# EAGLE design Hub USB 2.0 (EAGLE 7.7.0)
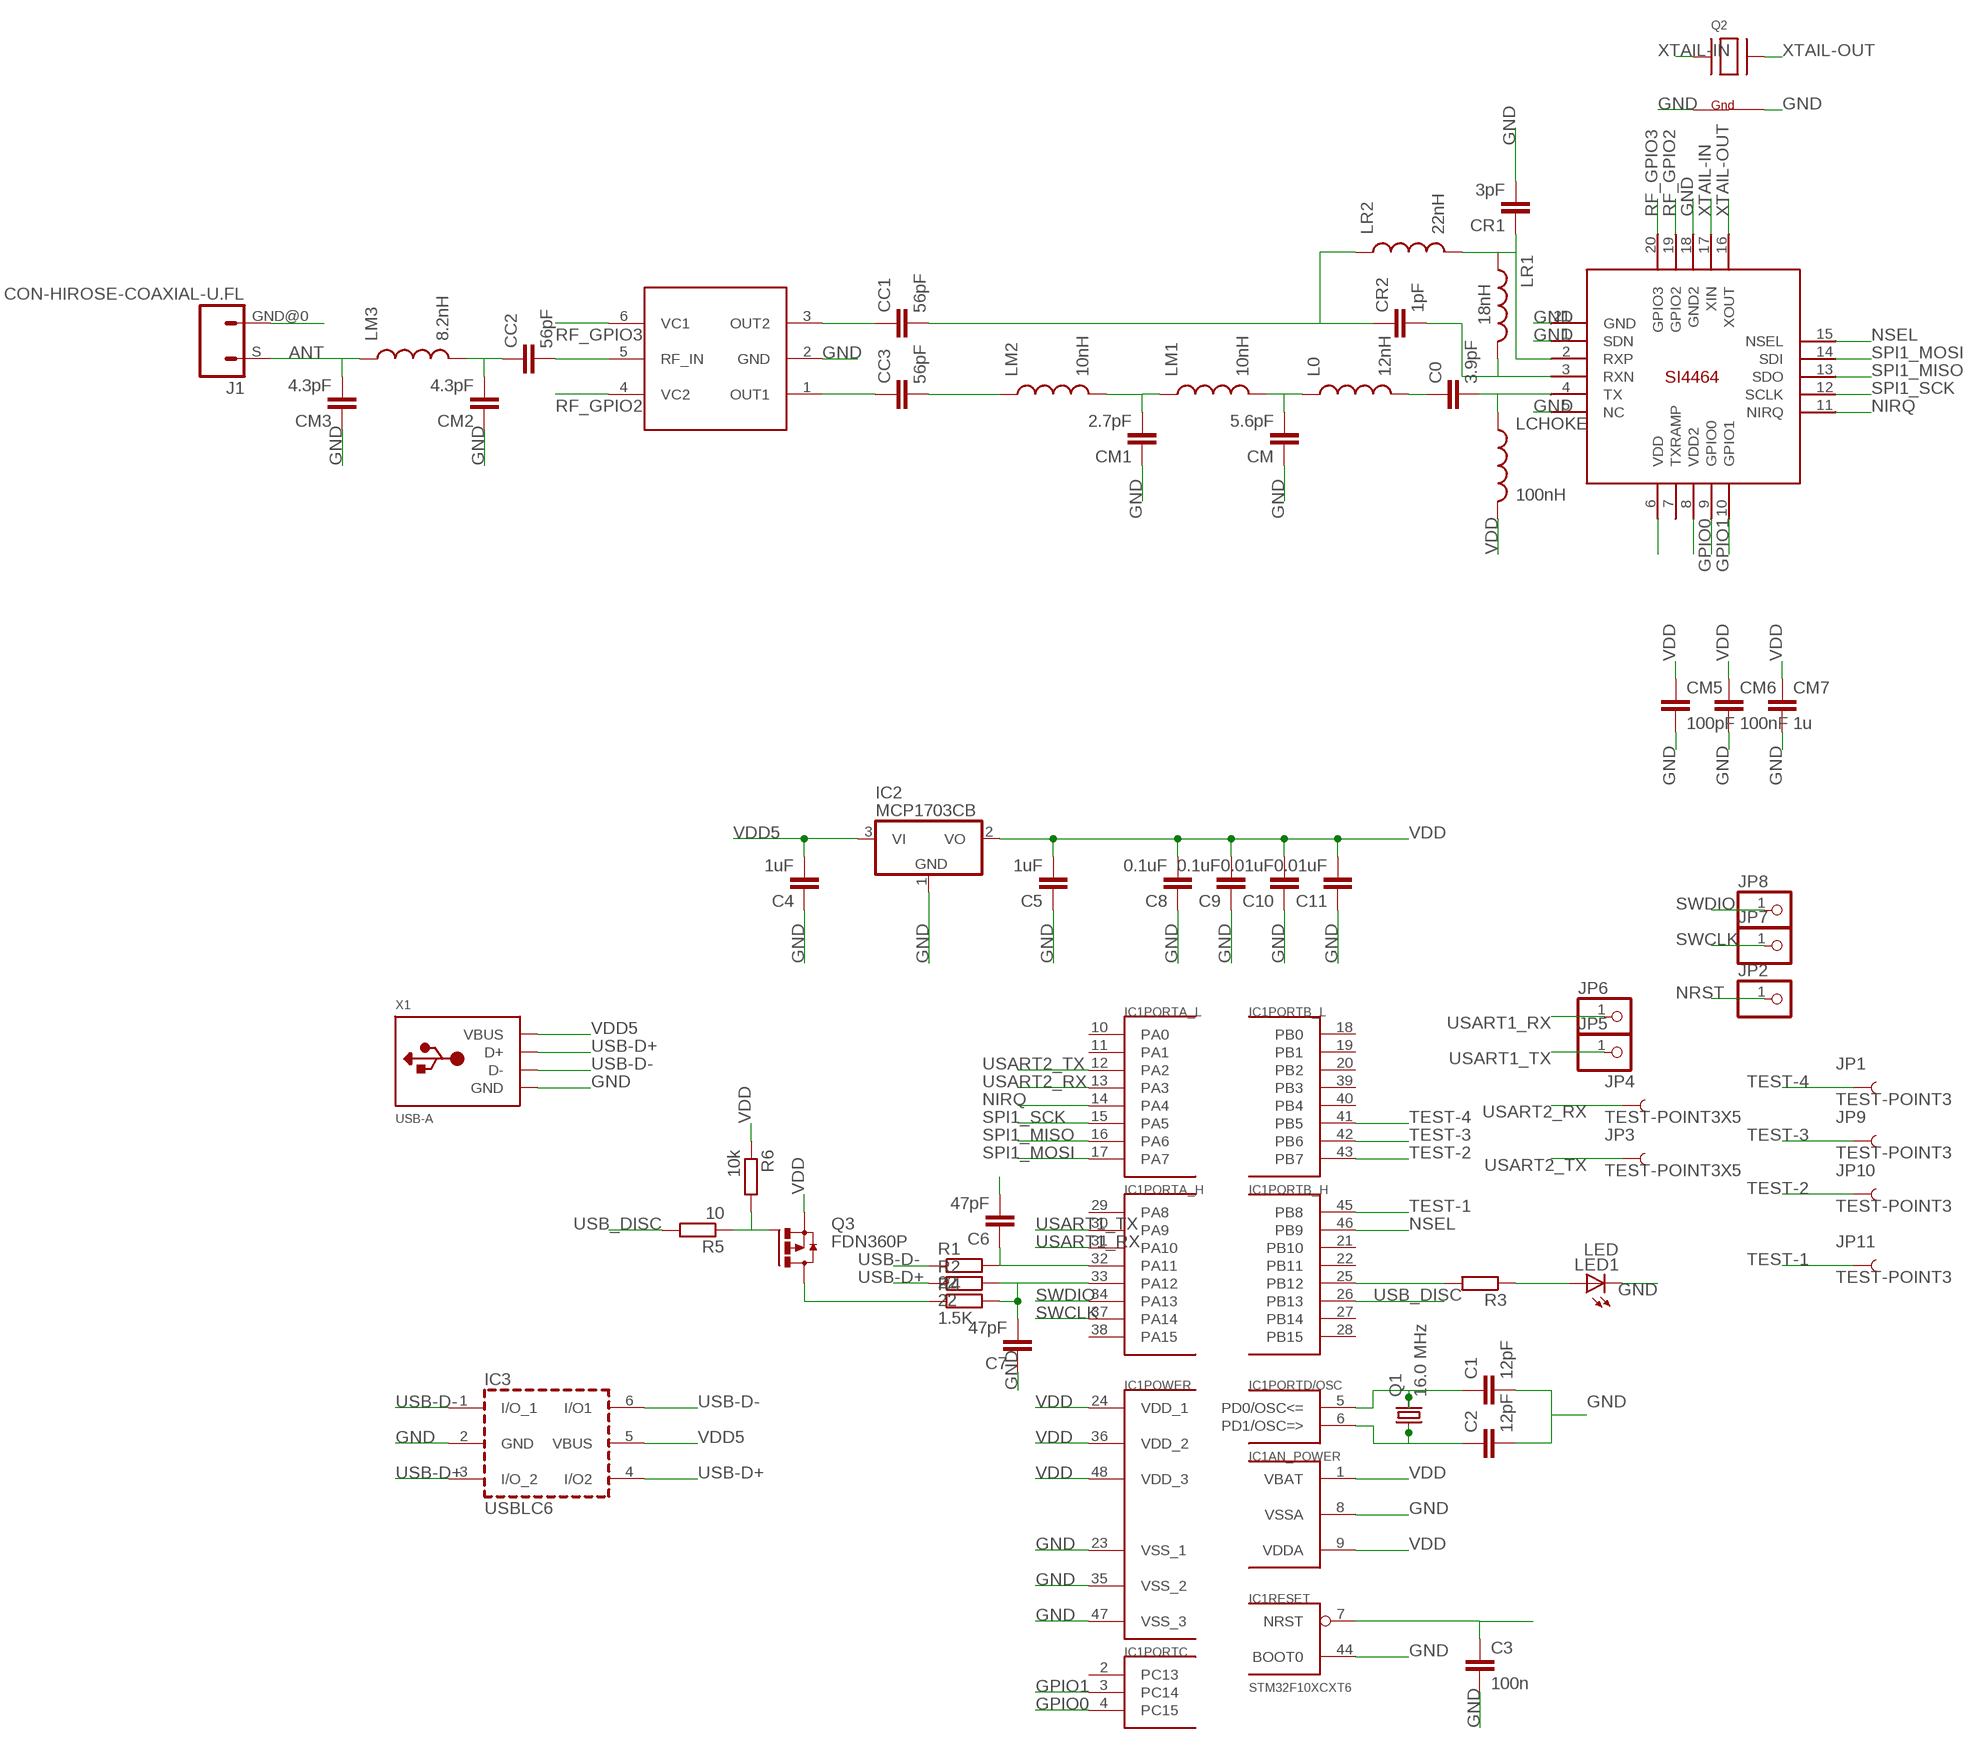
[diagram p0: schematic, sheet 1]

## Parts
C0  3.9pF  C-EUC0402  [C0402]
C1  12pF  C-EUC0603K  [C0603K]
C2  12pF  C-EUC0603K  [C0603K]
C3  100n  C-EUC0805  [C0805]
C4  1uF  C-EUC0805  [C0805]
C5  1uF  C-EUC0805  [C0805]
C6  47pF  C-EUC0805  [C0805]
C7  47pF  C-EUC0805  [C0805]
C8  0.1uF  C-EUC0805  [C0805]
C9  0.1uF  C-EUC0805  [C0805]
C10  0.01uF  C-EUC0805  [C0805]
C11  0.01uF  C-EUC0805  [C0805]
CC1  56pF  C-EUC0402  [C0402]
CC2  56pF  C-EUC0402  [C0402]
CC3  56pF  C-EUC0402  [C0402]
CM  5.6pF  C-EUC0402  [C0402]
CM1  2.7pF  C-EUC0402  [C0402]
CM2  4.3pF  C-EUC0402  [C0402]
CM3  4.3pF  C-EUC0402  [C0402]
CM5  100pF  C-EUC0402  [C0402]
CM6  100nF  C-EUC0402  [C0402]
CM7  1u  C-EUC0402  [C0402]
CR1  3pF  C-EUC0402  [C0402]
CR2  1pF  C-EUC0402  [C0402]
IC1  STM32F10XCXT6  [TQFP48]
IC2  MCP1703CB  [SOT23]
IC3  USBLC6  IC_USBLC6-2  [SOT-23-6L]
J1  CON-HIROSE-COAXIAL-U.FL  [CON-U.FL]
JP1  TEST-POINT3  [PAD.03X.03]
JP2  PINHD-1X1  [1X01]
JP3  TEST-POINT3X5  [PAD.03X.05]
JP4  TEST-POINT3X5  [PAD.03X.05]
JP5  PINHD-1X1CB  [1X01-CLEANBIG]
JP6  PINHD-1X1CB  [1X01-CLEANBIG]
JP7  PINHD-1X1  [1X01]
JP8  PINHD-1X1  [1X01]
JP9  TEST-POINT3  [PAD.03X.03]
JP10  TEST-POINT3  [PAD.03X.03]
JP11  TEST-POINT3  [PAD.03X.03]
L0  12nH  INDUCTOR0402  [C0402]
LCHOKE  100nH  INDUCTOR0402  [C0402]
LED1  LED  LEDCHIPLED_0805  [CHIPLED_0805]
LM1  10nH  INDUCTOR0402  [C0402]
LM2  10nH  INDUCTOR0402  [C0402]
LM3  8.2nH  INDUCTOR0402  [C0402]
LR1  18nH  INDUCTOR0402  [C0402]
LR2  22nH  INDUCTOR0402  [C0402]
Q1  16.0 MHz  CRYSTAL3.2X2.5  [CRYSTAL-SMD-3.2X2.5]
Q2  XTAL-4-3225  [NX3225]
Q3  FDN360P  [SUPER-SOT3]
R1  22  R-EU_R0805  [R0805]
R2  22  R-EU_R0805  [R0805]
R3  R-EU_R0805  [R0805]
R4  1.5K  R-EU_R0805  [R0805]
R5  10  R-EU_R0805  [R0805]
R6  10k  R-EU_R0805  [R0805]
U$1  SI4464  [QFN20+GNDPAD]
U$2  UPG2179TB  [SUPER_MINIMOLD]
X1  USB-A  [MOLEX_480371000]

## Nets
ANT: CM3.2 J1.S LM3.1
GND: C1.2 C2.2 C3.2 C4.1 C5.1 C6.2 C7.1 C8.1 C9.1 C10.1 C11.1 CM1.1 CM2.1 CM3.1 CM5.2 CM6.2 CM7.2 CM.1 CR1.2 IC1.8(AN_POWER:VSSA) IC1.23(POWER:VSS_1) IC1.35(POWER:VSS_2) IC1.44(RESET:BOOT0) IC1.47(POWER:VSS_3) IC2.1(GND) IC3.2(GND) J1.GND@0 LED1.C Q2.2(G2) Q2.4(G1) U$1.1(SDN) U$1.5(NC ) U$1.18(GND2) U$1.21(GND) U$2.2(GND) X1.4(GND)
GPIO0: IC1.4(PORTC:PC15) U$1.9(GPIO0)
GPIO1: IC1.3(PORTC:PC14) U$1.10(GPIO1)
N$1: C1.1 IC1.5(PORTD/OSC:PD0/OSC<=) Q1.3
N$2: C2.1 IC1.6(PORTD/OSC:PD1/OSC=>) Q1.1
N$3: C0.2 LCHOKE.1 U$1.4(TX)
N$4: LED1.A R3.1
N$5: C0.1 L0.2
N$6: C7.2 IC1.33(PORTA_H:PA12) R2.2 R4.2
N$7: CM.2 L0.1 LM1.2
N$8: CM1.2 LM1.1 LM2.2
N$9: CC2.1 CM2.2 LM3.2
N$10: C6.1 IC1.32(PORTA_H:PA11) R1.2
N$11: CC3.1 U$2.1(OUT1)
N$12: CR2.2 LR1.2 U$1.3(RXN)
N$13: CC1.1 U$2.3(OUT2)
N$14: CR1.1 LR1.1 LR2.2 U$1.2(RXP)
N$15: IC1.25(PORTB_H:PB12) R3.2
N$16: CC2.2 U$2.5(RF_IN)
N$17: CC3.2 LM2.1
N$18: CC1.2 CR2.1 LR2.1
N$19: Q3.3(D) R4.1
N$20: Q3.1(G) R5.1 R6.2
NIRQ: IC1.14(PORTA_L:PA4) U$1.11(NIRQ)
NRST: C3.1 IC1.7(RESET:NRST) JP2.1
NSEL: IC1.46(PORTB_H:PB9) U$1.15(NSEL)
RF_GPIO2: U$1.19(GPIO2) U$2.4(VC2)
RF_GPIO3: U$1.20(GPIO3) U$2.6(VC1)
SPI1_MISO: IC1.16(PORTA_L:PA6) U$1.13(SDO)
SPI1_MOSI: IC1.17(PORTA_L:PA7) U$1.14(SDI)
SPI1_SCK: IC1.15(PORTA_L:PA5) U$1.12(SCLK)
SWCLK: IC1.37(PORTA_H:PA14) JP7.1
SWDIO: IC1.34(PORTA_H:PA13) JP8.1
TEST-1: IC1.45(PORTB_H:PB8) JP11.P$1
TEST-2: IC1.43(PORTB_L:PB7) JP10.P$1
TEST-3: IC1.42(PORTB_L:PB6) JP9.P$1
TEST-4: IC1.41(PORTB_L:PB5) JP1.P$1
USART1_RX: IC1.31(PORTA_H:PA10) JP6.1
USART1_TX: IC1.30(PORTA_H:PA9) JP5.1
USART2_RX: IC1.13(PORTA_L:PA3) JP4.P$1
USART2_TX: IC1.12(PORTA_L:PA2) JP3.P$1
USB-D+: IC3.3(I/O_2) IC3.4(I/O2) R2.1 X1.3(D+)
USB-D-: IC3.1(I/O_1) IC3.6(I/O1) R1.1 X1.2(D-)
USB_DISC: IC1.26(PORTB_H:PB13) R5.2
VDD: C5.2 C8.2 C9.2 C10.2 C11.2 CM5.1 CM6.1 CM7.1 IC1.1(AN_POWER:VBAT) IC1.9(AN_POWER:VDDA) IC1.24(POWER:VDD_1) IC1.36(POWER:VDD_2) IC1.48(POWER:VDD_3) IC2.2(VO) LCHOKE.2 Q3.2(S) R6.1 U$1.6(VDD) U$1.8(VDD2)
VDD5: C4.2 IC2.3(VI) IC3.5(VBUS) X1.1(VBUS)
XTAIL-IN: Q2.1(X1) U$1.17(XIN)
XTAIL-OUT: Q2.3(X2) U$1.16(XOUT)
Unconnected: IC1.2(PORTC:PC13) IC1.10(PORTA_L:PA0) IC1.11(PORTA_L:PA1) IC1.18(PORTB_L:PB0) IC1.19(PORTB_L:PB1) IC1.20(PORTB_L:PB2) IC1.21(PORTB_H:PB10) IC1.22(PORTB_H:PB11) IC1.27(PORTB_H:PB14) IC1.28(PORTB_H:PB15) IC1.29(PORTA_H:PA8) IC1.38(PORTA_H:PA15) IC1.39(PORTB_L:PB3) IC1.40(PORTB_L:PB4) U$1.7(TXRAMP)

## Library data of the parts
C0 C1-C11 CC1-CC3 CM CM1-CM3 CM5-CM7 CR1 CR2 = resistor:C-EU: CAPACITOR, European symbol
IC1 = stm32:STM32F10XCXT6: ST STM32F101/103 48pin LQFP
IC2 = linear:MCP1703: 250 mA, 16V, Low Quiescent Current LDO Regulator Source: http://ww1.microchip.com/downloads/en/DeviceDoc/22049b.pdf
IC3 = dp_devices:IC_USBLC6-2
J1 = m-pad-2.1:CON-HIROSE-COAXIAL: Hirose SMT 50 ohm impedance connector W.FL ............................. 1.4mm mated height, ultra small SMT connectors .................................. DC to 3GHz U.FL .............................. 1.9mm or 2.4mm mated height, ultra small SMT connectors ................... DC to 6GHz E.FL ............................... 3.2mm mated height, ultra small SMT connectors .................................. DC to 2GHz H.FL .............................. 3.0mm mated height, ultra small SMT connectors ................................... DC to 3GHz S.FL. ............................. 6.0mm mated height, SMT connectors ................................................... DC to 2.5GHz FL ................................. 10.5mm mated height, SMT connectors .................................................. DC to 1.5GHz Please send any comments to: messi@users.sourceforge.net
JP1 JP3 JP4 JP9-JP11 = SparkFun-Passives:TEST-POINT: Bare copper test points for troubleshooting or ICT
JP2 JP7 JP8 = pinhead:PINHD-1X1: PIN HEADER
JP5 JP6 = adafruit:PINHD-1X1: Pin header 1x1 for 0.1" spacing With round pins
L0 LCHOKE LM1-LM3 LR1 LR2 = SparkFun-Passives:INDUCTOR: Inductors Basic Inductor/Choke - 0603 and 1206. Footprints are not proven and vary greatly between part numbers. INDUCTOR POWER 3.3UH 4.0A SMD 0.197" L x 0.197" W x 0.177" H (5.00mm x 5.00mm x 4.50mm)
LED1 = adafruit:LED: LED OSRAM: - CHIPLED LG R971, LG N971, LY N971, LG Q971, LY Q971, LO R971, LY R971 LH N974, LH R974 LS Q976, LO Q976, LY Q976 LO Q996 - Hyper CHIPLED LW Q18S LB Q993, LB Q99A, LB R99A - SideLED LS A670, LO A670, LY A670, LG A670, LP A670 LB A673, LV A673, LT A673, LW A673 LH A674 LY A675 LS A676, LA A676, LO A676, LY A676, LW A676 LS A679, LY A679, LG A679 - Hyper Micro SIDELED® LS Y876, LA Y876, LO Y876, LY Y876 LT Y87S - SmartLED LW L88C, LW L88S LB L89C, LB L89S, LG L890 LS L89K, LO L89K, LY L89K LS L896, LA L896, LO L896, LY L896 - TOPLED LS T670, LO T670, LY T670, LG T670, LP T670 LSG T670, LSP T670, LSY T670, LOP T670, LYG T670 LG T671, LOG T671, LSG T671 LB T673, LV T673, LT T673, LW T673 LH T674 LS T676, LA T676, LO T676, LY T676, LB T676, LH T676, LSB T676, LW T676 LB T67C, LV T67C, LT T67C, LS T67K, LO T67K, LY T67K, LW E67C LS E67B, LA E67B, LO E67B, LY E67B, LB E67C, LV E67C, LT E67C LW T67C LS T679, LY T679, LG T679 LS T770, LO T770, LY T770, LG T770, LP T770 LB T773, LV T773, LT T773, LW T773 LH T774 LS E675, LA E675, LY E675, LS T675 LS T776, LA T776, LO T776, LY T776, LB T776 LHGB T686 LT T68C, LB T68C - Hyper Mini TOPLED® LB M676 - Mini TOPLED Santana® LG M470 LS M47K, LO M47K, LY M47K Source: http://www.osram.convergy.de/
Q1 = Eagle-JeeLabs:CRYSTAL: Crystals Various standard crystals. Proven footprints. Spark Fun Electronics SKU : COM-00534
Q2 = adafruit:XTAL-4: Classic 4-pin 3.2 x 2.5mm crystal
Q3 = transistor-power:FDN360P: Single P-Channel, PowerTrench (R) MOSFET Source: http://www.fairchildsemi.com/ds/FD/FDN360P.pdf
R1-R6 = resistor:R-EU_: RESISTOR, European symbol
U$1 = Ava:SI4464
U$2 = Ava:UPG2179TB: The μPG2179TB is a GaAs MMIC L, S-band SPDT (Single Pole Double Throw) switch for mobile phone and other L, S-band applications. This device operates with dual control voltages of 2.5 to 5.3 V. This device can operate from 0.05 to 3.0 GHz, with low insertion loss and high isolation. http://datasheet.octopart.com/UPG2179TB-E4-A-NEC-datasheet-26379.pdf Layout by Anthony Stirk M0UPU UNTESTED
X1 = adafruit:USB-A: USB type A 'plug' Used for things that can directly connect to a USB port, say USB key

## Board
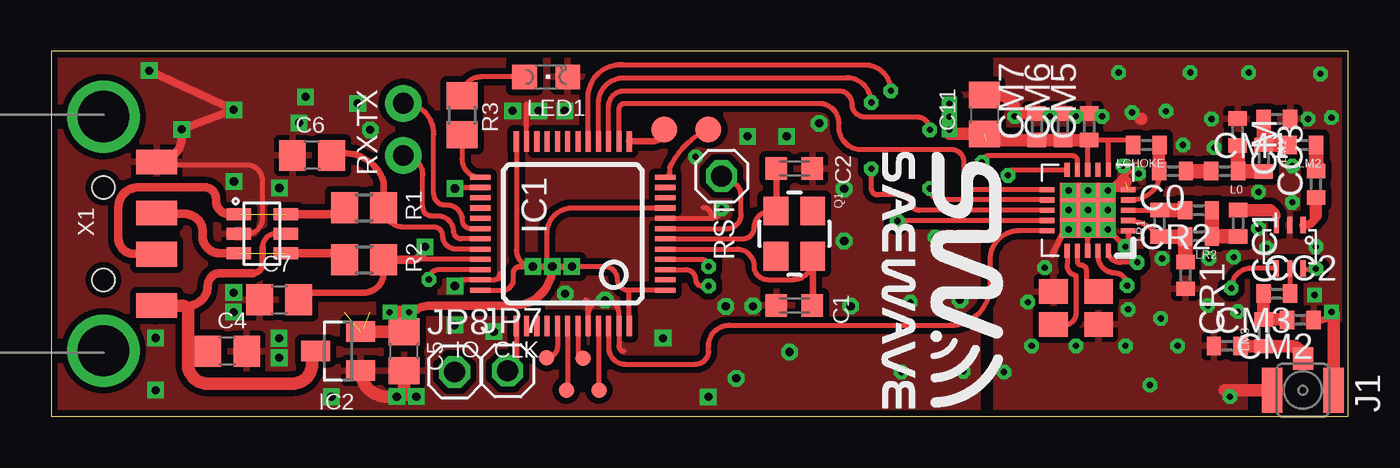
[diagram p1: board, top side]
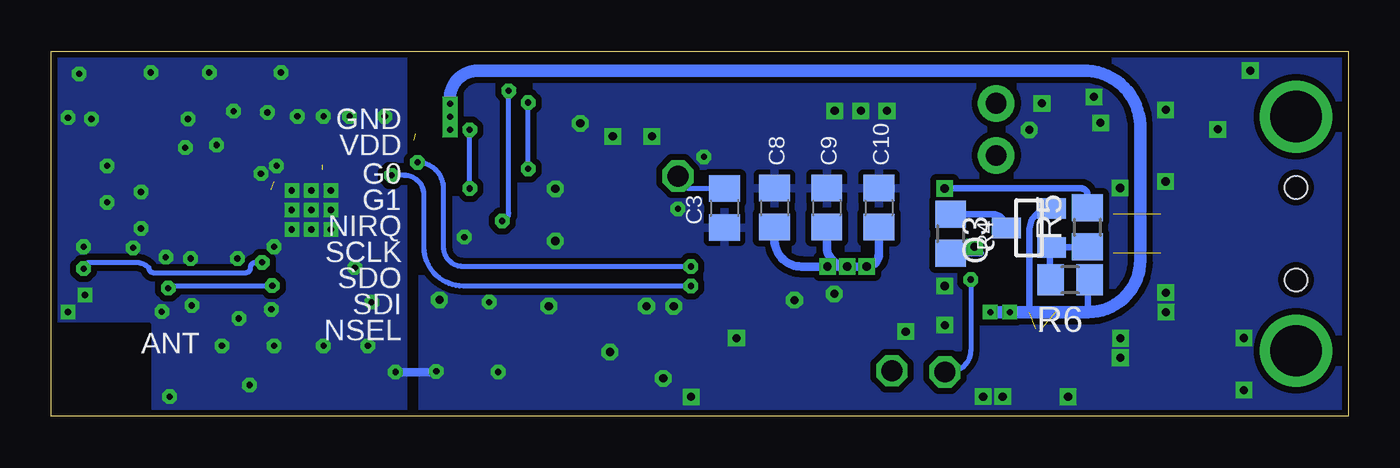
[diagram p2: board, bottom side, seen from below]

Size 63.17 x 17.77 mm. Coordinates in mm from the lower left corner, seen from the top.
Outline: 0,0 63.17,0 63.17,17.77 0,17.77 0,0
Copper layers (1*16): Top 0.035mm / dielectric 1.5mm / Bottom 0.035mm
Design rules "default *": minimum track width 6mil, minimum drill 11mil, track to track 8mil, track to pad 8mil, pad to pad 8mil, via to via 8mil, smd to smd 8mil, copper to edge 1mil, drill to drill 8mil, minimum pad ring 8mil, minimum via ring 8mil, stop-mask expansion 3mil, vias tented up to drill 17mil, thermal gap 10mil

### Footprints (pad centres in the part's own frame; a part is rotated, then mirrored left to right if it is on the bottom)
C0402 = smd 0.7 x 0.9: 1 -0.65,0; 2 0.65,0
C0603K = smd 1.05 x 1.08: 1 -0.875,0; 2 0.875,0
C0805 = smd 1.3 x 1.5: 1 -0.95,0; 2 0.95,0
TQFP48 = smd 0.25 x 1: 1 -2.75,-4.5; 2 -2.25,-4.5; 3 -1.75,-4.5; 4 -1.25,-4.5; 5 -0.75,-4.5; 6 -0.25,-4.5; 7 0.25,-4.5; 8 0.75,-4.5; 9 1.25,-4.5; 10 1.75,-4.5; 11 2.25,-4.5; 12 2.75,-4.5; 25 2.75,4.5; 26 2.25,4.5; 27 1.75,4.5; 28 1.25,4.5; 29 0.75,4.5; 30 0.25,4.5; 31 -0.25,4.5; 32 -0.75,4.5; 33 -1.25,4.5; 34 -1.75,4.5; 35 -2.25,4.5; 36 -2.75,4.5 | smd 1 x 0.25: 13 4.5,-2.75; 14 4.5,-2.25; 15 4.5,-1.75; 16 4.5,-1.25; 17 4.5,-0.75; 18 4.5,-0.25; 19 4.5,0.25; 20 4.5,0.75; 21 4.5,1.25; 22 4.5,1.75; 23 4.5,2.25; 24 4.5,2.75; 37 -4.5,2.75; 38 -4.5,2.25; 39 -4.5,1.75; 40 -4.5,1.25; 41 -4.5,0.75; 42 -4.5,0.25; 43 -4.5,-0.25; 44 -4.5,-0.75; 45 -4.5,-1.25; 46 -4.5,-1.75; 47 -4.5,-2.25; 48 -4.5,-2.75
SOT23 = smd 1 x 1.4: 1 -0.95,-1.1; 2 0.95,-1.1; 3 0,1.1
SOT-23-6L = smd 0.6 x 1.2: 1 -0.95,-2.3; 2 0,-2.3; 3 0.95,-2.3; 4 0.95,0; 5 0,0; 6 -0.95,0
CON-U.FL = smd 1 x 2.2: GND@0 -1.5,0; GND@1 1.5,0 | smd 1 x 1.1: S 0,-1.55
PAD.03X.03 = smd 0.762 x 0.762: P$1 0,0
1X01 = drill 1.016 octagon: 1 0,0
PAD.03X.05 = smd 1.27 x 1.27: P$1 0,0
1X01-CLEANBIG = drill 1.016 pad 1.778: 1 0,0
CHIPLED_0805 = smd 1.2 x 1.2: A 0,-1.05; C 0,1.05
CRYSTAL-SMD-3.2X2.5 = smd 1.4 x 1.2: 1 -1.1,-0.9; 2 1.1,-0.9; 3 1.1,0.9; 4 -1.1,0.9
NX3225 = smd 1.4 x 1.2: 1 -1.1,-0.8; 2 1.1,-0.8; 3 1.1,0.8; 4 -1.1,0.8
SUPER-SOT3 = smd 1 x 1.4: 1 -0.95,-1.1; 2 0.95,-1.1; 3 0,1.1
R0805 = smd 1.3 x 1.5: 1 -0.95,0; 2 0.95,0
QFN20+GNDPAD = smd 0.7 x 0.25: 1 -1.97,1; 2 -1.97,0.5; 3 -1.97,0; 4 -1.97,-0.5; 5 -1.97,-1; 11 1.97,-1; 12 1.97,-0.5; 13 1.97,0; 14 1.97,0.5; 15 1.97,1 | smd 0.25 x 0.7: 6 -1,-1.97; 7 -0.5,-1.97; 8 0,-1.97; 9 0.5,-1.97; 10 1,-1.97; 16 1,1.97; 17 0.5,1.97; 18 0,1.97; 19 -0.5,1.97; 20 -1,1.97 | smd 2.7 x 2.7: 21 0,0
SUPER_MINIMOLD = smd 0.8 x 0.25: 1 -1.05,0.65; 2 -1.05,0; 3 -1.05,-0.65; 4 1.05,-0.65; 5 1.05,0; 6 1.05,0.65
MOLEX_480371000 = smd 1.2 x 2: 1 3.5,2.6; 2 1,2.6; 3 -1,2.6; 4 -3.5,2.6 | drill 2.5: M1 -5.7,0; M2 5.7,0 | hole 1.1: -2.25,0; 2.25,0

### Placement (x,y rotation side)
C0  54.61,11.94 180 top
C1  36.2,5.4 180 top
C2  36.2,12.06 0 top
C3  30.38,10.14 270 bottom
C4  8.57,3.17 180 top
C5  17.18,3.16 90 top
C6  12.7,12.7 180 top
C7  11.1,5.68 0 top
C8  22.86,10.16 270 bottom
C9  27.94,10.16 270 bottom
C10  25.4,10.16 270 bottom
C11  45.45,14.7 270 top
CC1  57.8,9.4 270 top
CC2  59.69,5.97 0 top
CC3  61.59,11.3 90 top
CM  57.78,13.84 270 top
CM1  59.69,14.48 180 top
CM2  60.83,4.7 180 top
CM3  57.28,3.43 0 top
CM5  50.55,14.1 90 top
CM6  49.28,14.1 90 top
CM7  48.01,14.1 90 top
CR1  55.24,6.86 270 top
CR2  55.88,10.03 180 top
IC1  25.4,8.89 90 top
IC2  13.97,3.17 90 top
IC3  11.43,8.89 270 top
J1  60.96,1.27 180 top
JP1  24.13,2.86 0 top
JP2  32.64,11.69 0 top
JP3  32,13.97 0 top
JP4  29.85,13.97 0 top
JP5  17.15,15.24 0 top
JP6  17.15,12.7 0 top
JP7  22.23,2.22 0 top
JP8  19.64,2.16 0 top
JP9  25.09,1.27 0 top
JP10  25.9,2.83 0 top
JP11  26.67,1.27 0 top
L0  57.15,11.94 180 top
LCHOKE  53.34,13.21 180 top
LED1  24.1,16.52 270 top
LM1  59.05,12.57 270 top
LM2  60.96,13.21 180 top
LM3  59.05,4.06 90 top
LR1  53.97,9.4 90 top
LR2  55.88,8.76 180 top
Q1  36.2,8.89 270 top
Q2  49.91,5.27 180 top
Q3  15.55,9.17 90 bottom
R1  15.24,10.16 0 top
R2  15.24,7.62 0 top
R3  20,14.66 270 top
R4  19.37,8.89 270 bottom
R5  12.7,9.21 90 bottom
R6  13.55,6.64 180 bottom
U$1  50.48,10.03 180 top
U$2  60.32,8.25 270 top
X1  2.54,8.89 270 top

### Tracks (layer width: path | path; a pad name or v marks a point on that pad's centre or on a via)
ANT
  Top 0.61: CM3.2 57.93,3.41 LM3.1 60.37,3.41 arc-90 J1.S
GND  (via drill 0.3, 0.4)  (1 unrouted)
  Top 0.2: 23.15,15.21 23.14,15.22
  Top 0.254: v19.65,6.34 19.95,6.64 IC1.35 21.54,6.64 arc90 21.87,6.97 | IC3.2 9.54,8.89 arc90 10.29,9.64 10.29,11.47 arc90 9.53,12.23 5.3,12.23 arc-90 X1.4 | IC1.23 23.14,13.4 23.14,15.22 | U$1.18 50.48,9.4 | 50.48,9.4 U$1.21 arc-90 51.48,11.03 U$1.5 | 50.85,9.03 arc-90 50.48,9.4 | 51.49,9.09 v52.32,8.26 arc90 52.45,8.38 U$1.1 | IC1.8 32.15,9.64 | 32.15,9.64 arc90 v32.65,10.1 | 32.15,9.64 32.15,9.76 arc90 31.75,10.16 | IC1.44 26.15,4.91 | 26.15,4.91 arc-90 26.95,5.71 arc-90 27.65,5 IC1.47 27.65,3.42 arc90 27.9,3.17 | 26.15,4.91 26.15,5.52 arc90 26.02,5.65
  Top 0.305: v51.46,9.09 51.49,9.09 | v49.55,9.09 49.35,9.09 48.77,7.87 | v49.55,10.99 49.55,11.03 | v51.46,10.99 51.51,10.99 52.45,11.94 | CM2.1 61.66,4.7 arc90 v62.36,5.08
  Top 0.406: v17.78,0.95 v16.83,0.95 | X1.4 arc90 6.35,13.6 v6.35,13.97 | v6.35,13.97 v8.89,14.92 v4.77,16.83 | v6.35,13.97 arc90 v6.35,13.97
  Top 0.61: 53.07,14.49 53.09,14.48 | 52.32,11.43 52.2,11.43 52.07,11.3 | C11.1 46.2,15.65 arc-90 v46.93,14.61 46.93,14.75 CM7.2 | IC2.1 arc-90 IC2.1 arc90 16.34,0.95 v16.83,0.95 arc90 17.18,1.31 C5.1 | J1.GND@0 62.46,4.98 arc90 v62.36,5.08 | v57.41,0.95 57.41,1.01 arc90 57.15,1.27 59.69,1.27
  Bottom 0.406: v16.83,0.95 arc-90 v16.83,0.95 | v46.41,2.15 44.42,2.15 v44.42,2.19
  other vias: 5.08,1.27 11.09,3.8 29.8,3.8 32.01,0.95 33.92,13.63 35.82,13.63 37.4,14.26 22.47,14.87 13.64,0.95 12.38,15.56 5.08,3.81 12.07,14.29 11.1,2.85 8.88,5.07 8.88,6.02 21.55,4.12 19.65,4.44 11.11,11.11 15.53,13.95 23.74,14.87 25.01,14.87 34.18,5.36 38.93,5.36 38.62,8.54 38.62,11.08 44.26,5.67 35.96,3.13 33.36,1.85 8.89,11.43 14.92,15.24 57.79,5.1 58.8,9.14 56.33,5.4 61.59,8.26 59.18,8.2 60.45,10.41 60.45,12.19 62.36,14.54 61.21,14.48 56.52,14.48 56.64,13.08 55.12,13.21 58.8,10.92 51.46,10.04 50.51,10.99 49.55,10.04 50.51,9.09 50.51,10.04 52.96,11.81 52.2,12.19 52.64,14.79 51.18,14.61 48.64,14.61 49.91,14.61 54.04,4.76 54.1,7.68 52.45,5.21 52.32,3.43 49.91,3.43 47.75,3.43 48.39,7.24 54.86,3.43 54.29,14.86 47.56,5.56 56.39,7.68 57.59,7.75 61.53,5.91 41.4,2.16 41.85,5.56 43.05,8.72 53.51,1.52 51.99,16.74 55.47,16.74 58.33,16.74 61.81,16.68 26.97,5.65 25.03,5.96 31.38,12.64 32.86,5.36
  pour Bottom (isolate 0.305): 0,0 0,17.78 45.09,17.78 45.09,0
  pour Top (isolate 0.305): 0,17.78 45.11,17.78 45.11,0 0,0
  pour Bottom (isolate 0.305): 63.5,17.78 46.04,17.78 46.04,0 63.5,0
  pour Top (isolate 0.305): 63.5,17.78 46.04,17.78 46.04,0 63.5,0
GPIO0  (via drill 0.3)  (1 unrouted)
  Top 0.254: IC1.4 31.67,7.64 arc-90 v32.02,7.29 | 49.98,12.25 49.98,12.47 arc90 49.77,12.68 45.65,12.68 arc90 v45.33,12.36
  Bottom 0.254: v32.02,7.29 43.11,7.29 arc90 44.06,8.24 44.06,11.1 arc-90 v45.33,12.36
GPIO1  (via drill 0.3)
  Top 0.254: IC1.3 30.9,7.14 arc-90 31.38,6.66 arc90 31.7,6.34 v32.02,6.34 | v46.6,11.73 arc-90 46.87,12 U$1.10
  Bottom 0.254: v32.02,6.34 43.11,6.34 arc90 45.01,8.24 45.01,10.78 arc-90 45.97,11.73 v46.6,11.73
N$1
  Top 0.2: 37.09,7.61 Q1.3
  Top 0.254: IC1.5 33.39,8.14 arc-90 34.24,7.29 arc90 34.87,6.66 36.14,6.66 arc90 37.09,7.61
  Top 0.305: C1.1 arc90 37.09,5.42 Q1.3
N$2
  Top 0.2: Q1.1 35.03,9.99
  Top 0.254: IC1.6 33.68,8.64 arc90 34.24,9.19 arc-90 35.03,9.99
  Top 0.305: Q1.1 arc90 35.32,10.02 C2.1
N$3
  Top 0.254: U$1.4 52.56,10.53 arc45 53.67,10.99 arc56 C0.2
  Top 0.61: C0.2 53.96,13.18 arc-90 LCHOKE.1
N$4
  Top 0.254: LED1.A 20.92,16.52 arc90 R3.1
N$5
  Top 0.7: C0.1 L0.2
N$6  (via drill 0.4)
  Top 0.2: 16.84,7.64 arc90 R2.2
  Top 0.254: IC1.33 16.84,7.64
  Top 0.305: R2.2 16.19,7 arc-90 15.22,6.02 12.39,6.02 arc90 C7.2
  Top 0.406: v18.2,8.25 arc-90 17.57,7.62 R2.2
  Bottom 0.305: R4.2 17.89,7.94 arc90 v18.2,8.25
N$7
  Top 0.7: CM.2 arc-90 57.8,13.18 L0.1 LM1.2
N$8
  Top 0.7: CM1.2 arc-90 59.05,14.46 LM1.1 60.29,13.22 arc-90 LM2.2
N$9
  Top 0.61: CM2.2 60.18,4.71 LM3.2 CC2.1
N$10
  Top 0.254: IC1.32 19.71,8.14 arc-90 19.06,8.79 arc90 18.63,9.22 17.14,9.22 arc-90 R1.2
  Top 0.305: R1.2 16.19,11.43 arc90 C6.1
N$11
  Top 0.406: U$2.1 arc90 61.59,9.8
  Top 0.61: 61.59,9.8 CC3.1
N$12
  Top 0.254: U$1.3 53.96,10.03 arc90 LR1.2
  Top 0.7: 53.96,10.03 CR2.2
N$13
  Top 0.254: U$2.3 59.67,9.74 | 57.81,10.04 arc-90 CC1.1
  Top 0.406: 59.67,9.74 arc90 59.38,10.04
  Top 0.61: 59.38,10.04 57.81,10.04
N$14
  Top 0.254: U$1.2 arc-45 53.71,9.01 LR1.1
  Top 0.7: LR1.1 55.21,8.75 arc90 LR2.2 arc-90 55.24,8.75 CR1.1
N$15
  Top 0.254: R3.2 20,12.54 arc90 IC1.25
N$16
  Top 0.254: U$2.5 60.32,6 arc-45 CC2.2
N$17
  Top 0.7: LM2.1 61.61,11.97 arc-90 CC3.2
N$18
  Top 0.7: CR2.1 LR2.1 57.79,8.76 arc-90 CC1.2
N$19
  Bottom 0.305: Q3.3 arc-90 17.32,9.84 R4.1
N$20
  Bottom 0.305: R5.1 arc90 12.73,8.22 Q3.1 arc-90 14.56,8.12 R6.2
N$22
  cutout Bottom: 63.5,0 63.5,4.45 58.42,4.45 58.42,0
N$23
  cutout Top: 63.5,0 63.5,4.44 58.42,4.44 58.42,0
NIRQ
  Top 0.254: IC1.14 27.65,14.95 arc-90 27.94,15.24 37.38,15.24 arc-90 38.36,14.27 arc90 39.31,13 43.84,13 arc-90 44.45,12.38 44.45,11.43 arc90 44.85,11.03 U$1.11
NRST
  Top 0.254: IC1.7 32.91,9.14 arc90 33.6,9.83 33.6,10.78 arc90 32.97,11.41 32.92,11.41 arc-90 JP2.1
  Bottom 0.254: C3.1 32.04,11.09 arc90 JP2.1
NSEL
  Top 0.254: U$1.15 47.13,9.03 arc90 45.72,7.62 45.72,6.35 arc-90 43.81,4.44 33.02,4.44 arc90 32.02,3.43 32.02,3.17 arc-90 31.39,2.54 27.94,2.54 arc-90 27.15,3.33 IC1.46
RF_GPIO2  (via drill 0.3)
  Top 0.254: v52.41,6.36 arc90 51.78,6.99 51.82,6.99 arc-90 50.98,7.82 U$1.19 | U$2.4 58.44,7.2 arc90 v57.48,6.24
  Bottom 0.254: v57.48,6.24 arc-90 57.27,6.35 52.73,6.35 arc-90 v52.41,6.36
RF_GPIO3  (via drill 0.3)
  Top 0.254: U$2.6 61.48,7.08 arc90 v61.6,7.19 | v52.9,7.49 52.05,7.49 arc-90 U$1.20
  Bottom 0.254: v61.6,7.19 arc90 61.29,7.49 59.05,7.49 arc44 58.42,7.24 arc-90 58.17,6.99 53.72,6.99 arc-90 53.47,7.24 arc90 53.21,7.49 v52.9,7.49
SPI1_MISO  (via drill 0.3)
  Top 0.254: IC1.16 26.65,15.24 arc-90 27.89,16.48 38.74,16.48 arc-90 v39.94,15.28 | U$1.13 42.27,10.03 arc-90 41.84,10.46 arc90 41.53,10.78 40.26,10.78 arc-90 39.94,11.1 v39.94,12.04 arc90 v39.94,12.05
  Bottom 0.254: v39.94,12.05 v39.94,15.28
SPI1_MOSI  (via drill 0.3)  (1 unrouted)
  Top 0.254: IC1.17 26.15,15.69 arc-90 27.89,17.12 | U$1.14 41.23,9.53 | 27.89,17.12 27.62,17.12 | 27.89,17.12 39.62,17.12 arc-90 v40.89,15.85
  Bottom 0.254: v41.21,9.51 41.29,9.51 arc-90 40.89,9.91 v40.89,15.85
SPI1_SCK  (via drill 0.3)
  Top 0.254: IC1.15 27.15,15.1 arc-90 27.9,15.85 38.36,15.85 arc-90 38.99,15.22 arc90 39.62,14.58 42.16,14.58 arc-90 v42.8,13.95 | U$1.12 43.36,10.53 arc-90 v42.8,11.1
  Bottom 0.254: v42.8,11.1 v42.8,13.95
SWCLK
  Top 0.254: IC1.37 22.65,2.65 arc-90 JP7.1
SWDIO  (via drill 0.3)
  Top 0.254: IC1.34 18.87,7.14 arc90 v18.39,6.66
  Bottom 0.254: v18.39,6.66 18.39,3.2 arc90 19.43,2.16 JP8.1
TEST-1
  Top 0.254: IC1.45 26.65,1.29 arc90 JP11.P$1
TEST-2
  Top 0.254: IC1.43 25.65,2.84 arc90 JP10.P$1
TEST-3
  Top 0.254: IC1.42 25.15,1.33 arc-90 JP9.P$1
TEST-4
  Top 0.254: IC1.41 24.65,3.38 arc-90 JP1.P$1
USART1_RX
  Top 0.254: IC1.31 19.96,8.64 arc-90 19.59,9 arc90 18.85,9.75 18.52,9.75 arc-90 18.1,10.18 18.1,11.75 arc90 JP6.1
USART1_TX
  Top 0.2: IC1.30 20.42,9.14
  Top 0.254: 20.42,9.14 arc-90 20.02,9.54 arc90 19.27,10.29 19.17,10.29 arc-90 18.63,10.82 18.63,13.75 arc90 JP5.1
USART2_RX
  Top 0.305: IC1.13 29.27,13.39 arc90 JP4.P$1
USART2_TX
  Top 0.254: JP3.P$1 arc44 30.11,12.05 30.11,11.86 arc-90 IC1.12
USB-D+  (1 unrouted)
  Top 0.406: IC3.3 8.2,7.94 arc-90 7.37,8.77 7.37,8.99 arc90 6.51,9.85 5.18,9.85 arc-90 X1.3 | IC3.4 14.61,7.94 arc-90 R2.1
USB-D-  (1 unrouted)
  Top 0.406: IC3.1 8.68,9.84 arc-90 8.02,10.5 8.02,10.61 arc90 7.48,11.15 4.24,11.15 arc90 3.27,10.18 3.27,8.67 arc90 4.02,7.91 5.12,7.91 arc-90 X1.2 | IC3.6 14.6,9.84 arc90 R1.1
USB_DISC  (via drill 0.4)
  Top 0.254: IC1.26 19.7,11.14 arc90 v19.65,11.09
  Bottom 0.305: v19.65,11.09 arc90 v19.65,11.1 13,11.1 arc90 12.7,10.8 R5.2
VDD  (via drill 0.3, 0.4)  (4 unrouted)
  Top 0.2: 28.15,6.08 arc90 28.09,6.14 | 24.13,7.57 arc90 v24.41,7.29
  Top 0.254: U$1.6 51.48,13.45 | U$1.8 50.48,13.26 CM5.1 51.48,13.45 | IC1.36 21.99,6.14 arc90 22.5,6.66 22.5,6.97 arc-90 22.82,7.29 v23.46,7.29 arc-90 22.65,8.1 IC1.24 | IC1.1 28.09,6.14 arc-90 27.58,6.66 arc90 26.94,7.29 v25.36,7.29 | IC1.48 28.15,6.08 | IC1.9 25.38,10.14 arc90 24.13,8.89 24.13,7.57 | 52.68,13.19 52.68,13.45 51.48,13.45
  Top 0.305: v23.46,7.29 v24.41,7.29 v25.36,7.29
  Top 0.406: C5.2 arc-90 18.46,5.39 22.5,5.39 arc90 v24.41,7.29 | 43.75,13.97 v43.75,13.95 v43.75,14.58
  Top 0.61: CM5.1 CM6.1 CM7.1 45.53,13.45 | C11.2 43.75,13.75 43.75,13.97 43.75,15.29 | 15.21,4.27 arc-90 IC2.2 arc90 15.08,4.11 C5.2 | v17.43,5.07 arc90 v17.43,5.08 16.51,5.08
  Top 0.7: LCHOKE.2 arc-90 52.68,13.19
  Bottom 0.254: 10.13,9.18 arc-90 10.16,9.15 10.16,8.89
  Bottom 0.305: Q3.2 arc-90 15.53,9.04 15.53,5.07 | R6.1 arc-90 12.68,6.57 12.68,5.07
  Bottom 0.406: v24.41,7.29 arc90 25.4,8.28 C10.2 | C8.2 22.86,7.89 arc90 v23.46,7.29 26.63,7.29 arc90 27.94,8.61 C9.2 | v43.75,15.22 43.75,15.29 | 15.53,5.07 16.51,5.07 16.51,5.08
  Bottom 0.61: 43.75,13.97 43.75,15.29 arc90 42.53,16.83 12.7,16.83 arc90 10.13,13.94 10.13,9.18 10.13,7.61 arc90 12.67,5.07 arc-90 12.68,5.07 15.53,5.07 v16.48,5.07 v17.43,5.07 | 14.26,5.07 arc-90 14.27,5.07
VDD5
  Top 0.254: IC3.5 10.94,8.89 arc90 10.29,8.23 | C4.2 7.3,3.17 arc-90 6.66,3.81
  Top 0.305: 10.29,8.23 10.29,7.43 arc-90 9.83,6.97 | 12.7,3.35 arc90 IC2.3
  Top 0.406: X1.1 6.35,5.39 6.66,5.39 arc90 7.62,6.35 arc-90 8.24,6.97 9.83,6.97
  Top 0.61: IC2.3 arc90 12.7,3 12.7,2.54 arc-90 11.74,1.58 7.61,1.58 arc-90 6.66,2.53 6.66,3.81 6.66,5.08 arc90 6.35,5.39 5.39,5.39 arc90 5.08,5.08
XTAIL-IN
  Top 0.254: U$1.17 49.98,7.55 arc90 50.16,7.37 arc-90 50.42,7.11 50.42,6.1 arc90 50.44,6.07 Q2.1
XTAIL-OUT
  Top 0.254: U$1.16 49.48,7.42 arc90 49.91,6.86 49.91,4.95 arc-90 49.28,4.45 48.84,4.45 arc-90 Q2.3

### Text on the board
tPlace: RX TX | RST | IO | CLK
bNames: GND | VDD | G0 | G1 | NIRQ | SCLK | SDO | SDI | NSEL | ANT
200bmp: E:/Projects/STM32/RemoteSwitch/FWUpdater/SW_Logo-mono.bmp